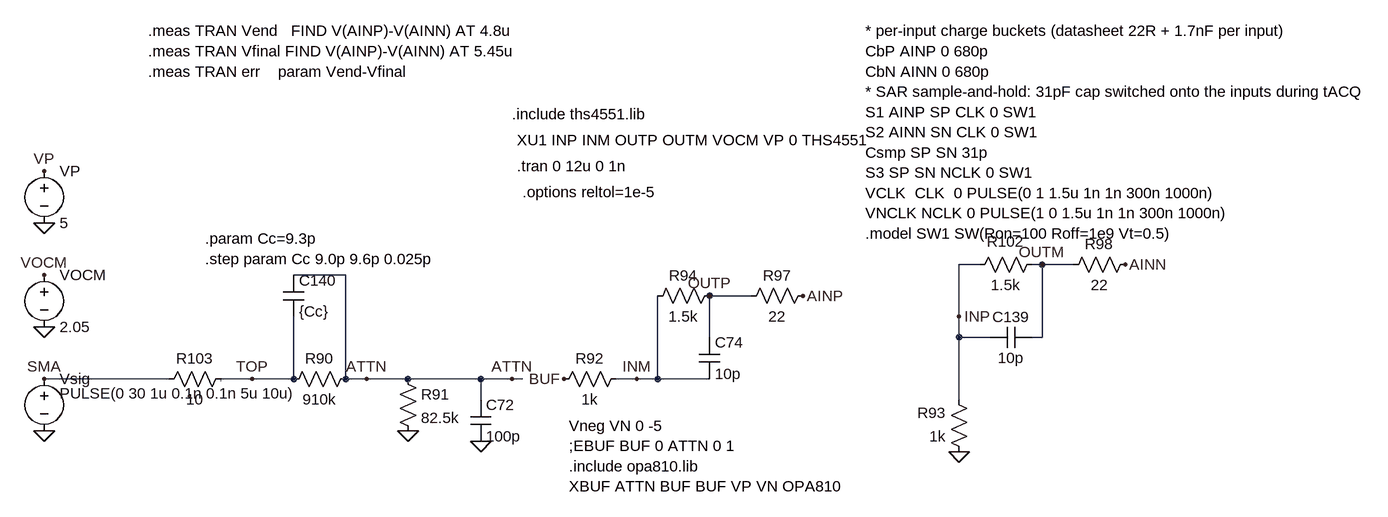
[diagram p0: schematic adc-v2.asc]
adc-v2.asc, the LTspice schematic file:
Version 4
SHEET 1 2032 680
WIRE 1440 256 1408 256
WIRE 1536 256 1520 256
WIRE 1584 256 1536 256
WIRE 464 272 384 272
WIRE 1088 304 1024 304
WIRE 1408 336 1408 256
WIRE 1024 368 1024 304
WIRE 1408 368 1408 336
WIRE 1456 368 1408 368
WIRE 1536 368 1536 256
WIRE 1536 368 1520 368
WIRE 192 432 0 432
WIRE 320 432 272 432
WIRE 384 432 384 336
WIRE 384 432 320 432
WIRE 464 432 464 272
WIRE 496 432 464 432
WIRE 560 432 496 432
WIRE 672 432 560 432
WIRE 720 432 672 432
WIRE 736 432 720 432
WIRE 912 432 880 432
WIRE 944 432 944 304
WIRE 944 432 912 432
WIRE 1024 432 944 432
WIRE 672 464 672 432
WIRE 1408 464 1408 368
FLAG 0 512 0
FLAG 0 352 0
FLAG 0 192 0
FLAG 0 432 SMA
FLAG 320 432 TOP
FLAG 496 432 ATTN
FLAG 560 512 0
FLAG 672 528 0
FLAG 912 432 INM
FLAG 1408 544 0
FLAG 1408 336 INP
FLAG 1024 304 OUTP
FLAG 1536 256 OUTM
FLAG 1168 304 AINP
FLAG 1664 256 AINN
FLAG 0 112 VP
FLAG 0 272 VOCM
FLAG 800 432 BUF
FLAG 720 432 ATTN
SYMBOL voltage 0 256 R0
SYMATTR InstName VOCM
SYMATTR Value 2.05
SYMBOL voltage 0 416 R0
WINDOW 3 24 38 Left 2
SYMATTR Value PULSE(0 30 1u 0.1n 0.1n 5u 10u)
SYMATTR InstName Vsig
SYMATTR Value2 AC 1 0
SYMBOL voltage 0 96 R0
SYMATTR InstName VP
SYMATTR Value 5
SYMBOL Res 288 416 R90
WINDOW 0 0 56 VBottom 2
WINDOW 3 32 56 VTop 2
SYMATTR InstName R103
SYMATTR Value 10
SYMBOL Res 480 416 R90
WINDOW 0 0 56 VBottom 2
WINDOW 3 32 56 VTop 2
SYMATTR InstName R90
SYMATTR Value 910k
SYMBOL Res 544 416 R0
SYMATTR InstName R91
SYMATTR Value 82.5k
SYMBOL Res 896 416 R90
WINDOW 0 0 56 VBottom 2
WINDOW 3 32 56 VTop 2
SYMATTR InstName R92
SYMATTR Value 1k
SYMBOL Res 1424 560 R180
WINDOW 0 36 76 Left 2
WINDOW 3 36 40 Left 2
SYMATTR InstName R93
SYMATTR Value 1k
SYMBOL Res 1040 288 R90
WINDOW 0 0 56 VBottom 2
WINDOW 3 32 56 VTop 2
SYMATTR InstName R94
SYMATTR Value 1.5k
SYMBOL Res 1536 240 R90
WINDOW 0 -4 56 VBottom 2
WINDOW 3 32 56 VTop 2
SYMATTR InstName R102
SYMATTR Value 1.5k
SYMBOL Cap 368 272 R0
SYMATTR InstName C140
SYMATTR Value {Cc}
SYMBOL Cap 656 464 R0
SYMATTR InstName C72
SYMATTR Value 100p
SYMBOL Cap 1008 368 R0
SYMATTR InstName C74
SYMATTR Value 10p
SYMBOL Cap 1520 352 R90
WINDOW 0 0 32 VBottom 2
WINDOW 3 32 32 VTop 2
SYMATTR InstName C139
SYMATTR Value 10p
SYMBOL Res 1184 288 R90
WINDOW 0 0 56 VBottom 2
WINDOW 3 32 56 VTop 2
SYMATTR InstName R97
SYMATTR Value 22
SYMBOL Res 1680 240 R90
WINDOW 0 0 56 VBottom 2
WINDOW 3 32 56 VTop 2
SYMATTR InstName R98
SYMATTR Value 22
TEXT 720 24 Left 2 !.include ths4551.lib
TEXT 728 64 Left 2 !XU1 INP INM OUTP OUTM VOCM VP 0 THS4551
TEXT 728 104 Left 2 !.tran 0 12u 0 1n
TEXT 808 504 Left 2 !Vneg VN 0 -5\n;EBUF BUF 0 ATTN 0 1\n.include opa810.lib\nXBUF ATTN BUF BUF VP VN OPA810
TEXT 736 144 Left 2 !.options reltol=1e-5
TEXT 1264 -104 Left 2 !* per-input charge buckets (datasheet 22R + 1.7nF per input)\nCbP AINP 0 680p\nCbN AINN 0 680p\n* SAR sample-and-hold: 31pF cap switched onto the inputs during tACQ\nS1 AINP SP CLK 0 SW1\nS2 AINN SN CLK 0 SW1\nCsmp SP SN 31p\nS3 SP SN NCLK 0 SW1\nVCLK  CLK  0 PULSE(0 1 1.5u 1n 1n 300n 1000n)\nVNCLK NCLK 0 PULSE(1 0 1.5u 1n 1n 300n 1000n)\n.model SW1 SW(Ron=100 Roff=1e9 Vt=0.5)
TEXT 160 -104 Left 2 !.meas TRAN Vend   FIND V(AINP)-V(AINN) AT 4.8u\n.meas TRAN Vfinal FIND V(AINP)-V(AINN) AT 5.45u\n.meas TRAN err    param Vend-Vfinal
TEXT 248 216 Left 2 !.param Cc=9.3p\n.step param Cc 9.0p 9.6p 0.025p
LINE Normal 272 436 272 432 2

The netlist it stands for:
* adc-v2.asc
VOCM VOCM 0 2.05
Vsig SMA 0 PULSE(0 30 1u 0.1n 0.1n 5u 10u) AC 1 0
VP VP 0 5
R103 TOP SMA 10
R90 ATTN TOP 910k
R91 ATTN 0 82.5k
R92 INM BUF 1k
R93 0 INP 1k
R94 OUTP INM 1.5k
R102 OUTM INP 1.5k
C140 ATTN TOP {Cc}
C72 ATTN 0 100p
C74 OUTP INM 10p
C139 OUTM INP 10p
R97 AINP OUTP 22
R98 AINN OUTM 22
.include ths4551.lib
XU1 INP INM OUTP OUTM VOCM VP 0 THS4551
.tran 0 12u 0 1n
Vneg VN 0 -5
;EBUF BUF 0 ATTN 0 1
.include opa810.lib
XBUF ATTN BUF BUF VP VN OPA810
.options reltol=1e-5
* per-input charge buckets (datasheet 22R + 1.7nF per input)
CbP AINP 0 680p
CbN AINN 0 680p
* SAR sample-and-hold: 31pF cap switched onto the inputs during tACQ
S1 AINP SP CLK 0 SW1
S2 AINN SN CLK 0 SW1
Csmp SP SN 31p
S3 SP SN NCLK 0 SW1
VCLK  CLK  0 PULSE(0 1 1.5u 1n 1n 300n 1000n)
VNCLK NCLK 0 PULSE(1 0 1.5u 1n 1n 300n 1000n)
.model SW1 SW(Ron=100 Roff=1e9 Vt=0.5)
.meas TRAN Vend   FIND V(AINP)-V(AINN) AT 4.8u
.meas TRAN Vfinal FIND V(AINP)-V(AINN) AT 5.45u
.meas TRAN err    param Vend-Vfinal
.param Cc=9.3p
.step param Cc 9.0p 9.6p 0.025p
.backanno
.end